# EAGLE design esp01-prog (EAGLE 7.6.0)
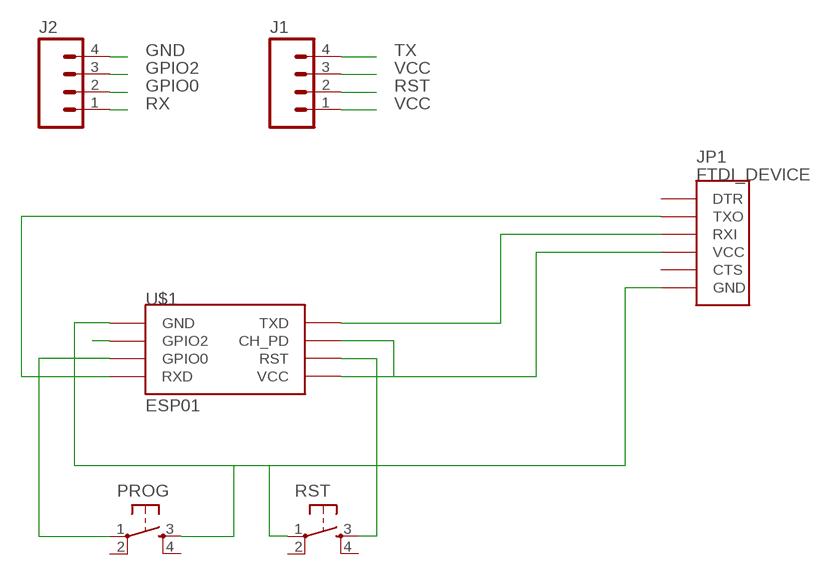
[diagram p0: schematic, sheet 1]

## Parts
J1  M04PTH  [1X04]
J2  M04PTH  [1X04]
JP1  FTDI_DEVICE  [FTDI_DEVICE_SIDE]
PROG  TACTILE-SWITCH-PTH  [TAC-SWITCH-PTH]
RST  TACTILE-SWITCH-PTH  [TAC-SWITCH-PTH]
U$1  ESP01  [ESP01]

## Nets
GND: J2.4 JP1.P$6(GND) PROG.3 RST.1 U$1.GND
GPIO0: J2.2 PROG.1 U$1.GPIO0
GPIO2: J2.3 U$1.GPIO2
RST: J1.2 RST.3 U$1.RST
RX: J2.1 JP1.P$2(TXO) U$1.RX(RXD)
TX: J1.4 JP1.P$3(RXI) U$1.TX(TXD)
VCC: J1.1 J1.3 JP1.P$4(VCC) U$1.CH_PD U$1.VCC
Unconnected: JP1.P$1(DTR) JP1.P$5(CTS) PROG.2 PROG.4 RST.2 RST.4

## Library data of the parts
J1 J2 = SparkFun-Connectors:M04: Header 4 Standard 4-pin 0.1" header. Use with straight break away headers (SKU : PRT-00116), right angle break away headers (PRT-00553), swiss pins (PRT-00743), machine pins (PRT-00117), and female headers (PRT-00115). Molex polarized connector foot print use with SKU : PRT-08231 with associated crimp pins and housings. 1MM SMD Version SKU: PRT-10208; PROD_ID: CONN-09696
JP1 = SparkFun-Connectors:FTDI_DEVICE: Connector which mates to FTDI basic or FTDI cable.
PROG RST = GeekAmmo:TACTILE-SWITCH: Tactile Switch 4 Pins, SPST NO
U$1 = esp8266modules:ESP01: ESP8266 Wifi module 01

## Board
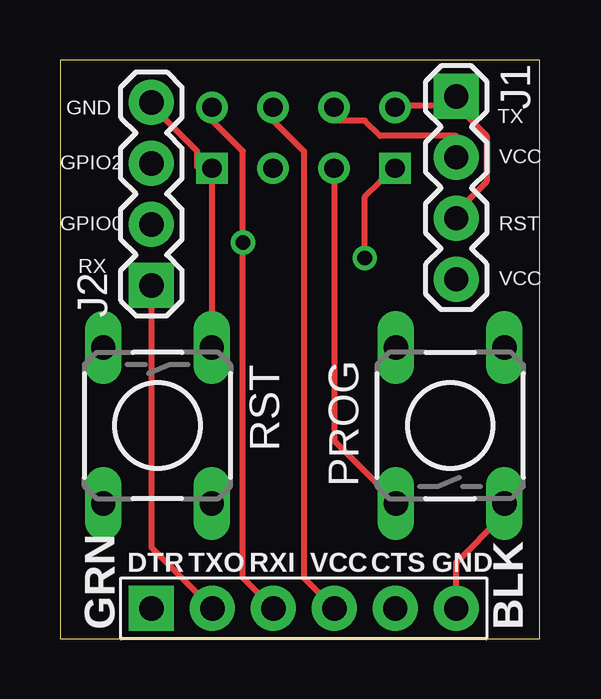
[diagram p1: board, top side]
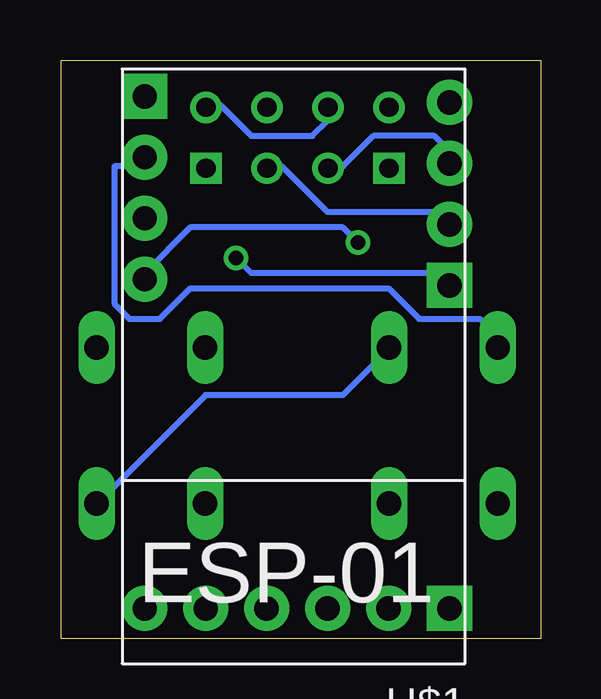
[diagram p2: board, bottom side, seen from below]

Size 19.99 x 24.12 mm. Coordinates in mm from the lower left corner, seen from the top.
Outline: 0,0 19.99,0 19.99,24.12 0,24.12 0,0
Copper layers (1*16): Top 0.035mm / dielectric 1.5mm / Bottom 0.035mm
Design rules "default": minimum track width 10mil, minimum drill 24mil, track to track 8mil, track to pad 8mil, pad to pad 8mil, via to via 8mil, smd to smd 8mil, copper to edge 40mil, drill to drill 8mil, minimum pad ring 10mil, minimum via ring 8mil, stop-mask expansion 4mil, vias tented up to drill 0mil, thermal gap 10mil

### Footprints (pad centres in the part's own frame; a part is rotated, then mirrored left to right if it is on the bottom)
1X04 = drill 1.016 pad 1.88 square: 1 0,0 | drill 1.016 pad 1.88: 2 2.54,0; 3 5.08,0; 4 7.62,0
FTDI_DEVICE_SIDE = drill 1.016 pad 1.88 square: P$1 -6.35,0 | drill 1.016 pad 1.88: P$2 -3.81,0; P$3 -1.27,0; P$4 1.27,0; P$5 3.81,0; P$6 6.35,0
TAC-SWITCH-PTH = drill 1.016 pad 1.524 long: 1 -3.251,2.261; 2 3.251,2.261; 3 -3.251,-2.261; 4 3.251,-2.261
ESP01 = drill 0.8: CH_PD -1.285,-8.178; GPIO0 1.255,-5.638; GPIO2 -1.285,-5.638; RST 1.255,-8.178; TX -3.825,-8.178; VCC 3.795,-8.178 | drill 0.8 square: GND -3.825,-5.638; RX 3.795,-5.638

### Placement (x,y rotation side)
J1  16.51,22.61 270 top
J2  3.81,14.73 90 top
JP1  10.16,1.27 0 top
PROG  16.26,8.89 90 top
RST  4.06,8.89 270 top
U$1  10.16,13.97 180 bottom

### Tracks (layer width: path | path; a pad name or v marks a point on that pad's centre or on a via)
GND
  Top 0.254: JP1.P$6 16.51,3.17 18.41,5.08 PROG.3 | RST.1 6.35,12.7 6.35,19.05 U$1.GND 5.71,19.68 5.71,20.32 3.81,22.23 J2.4
  Bottom 0.254: PROG.3 18.41,5.71 13.97,10.16 8.26,10.16 6.35,12.06 RST.1
GPIO0
  Top 0.254: PROG.1 13.97,5.71 11.43,8.26 11.43,19.05 U$1.GPIO0
  Bottom 0.254: U$1.GPIO0 10.79,19.68 8.89,17.78 3.81,17.78 J2.2
GPIO2
  Bottom 0.254: U$1.GPIO2 8.26,19.68 6.99,20.95 4.45,20.95 3.81,20.32 J2.3
RST
  Top 0.254: J1.2 16.51,20.95 13.34,20.95 12.7,21.59 11.43,21.59 U$1.RST
  Bottom 0.254: RST.3 1.91,12.7 2.54,13.34 5.08,13.34 6.35,14.61 14.61,14.61 15.88,13.34 17.14,13.34 17.78,13.97 17.78,19.68 16.51,19.68 J1.2
RX  (via drill 0.61)
  Top 0.254: v12.7,15.88 12.7,18.41 13.34,19.05 U$1.RX | JP1.P$2 3.81,3.81 J2.1
  Bottom 0.254: v12.7,15.88 12.06,15.24 3.81,15.24 J2.1
TX  (via drill 0.61)
  Top 0.254: JP1.P$3 7.62,2.54 v7.62,16.51 7.62,20.32 6.35,21.59 U$1.TX
  Bottom 0.254: v7.62,16.51 8.26,17.14 14.61,17.14 16.51,15.24 J1.4
VCC
  Top 0.254: 16.51,22.23 17.78,20.95 17.78,19.05 16.51,17.78 J1.3 | JP1.P$4 10.16,2.54 10.16,20.32 8.89,21.59 U$1.CH_PD | 16.51,22.23 13.97,22.23 U$1.VCC | 16.51,22.23 J1.1
  Bottom 0.254: U$1.CH_PD 8.89,21.59 9.53,20.95 12.06,20.95 13.34,22.23 U$1.VCC

### Text on the board
tNames: GND | TX | GPIO2 | VCC | GPIO0 | RST | RX | VCC